# Altium schematic sheet FPGA_51_Wave_Player.SchDoc: LiveDesign Evaluation - Wave Player
size A3; Organization: Altium Limited; Address1: L3, 12a Rodborough Rd; Address2: Frenchs Forest; Address3: NSW; Address4: Australia 2086
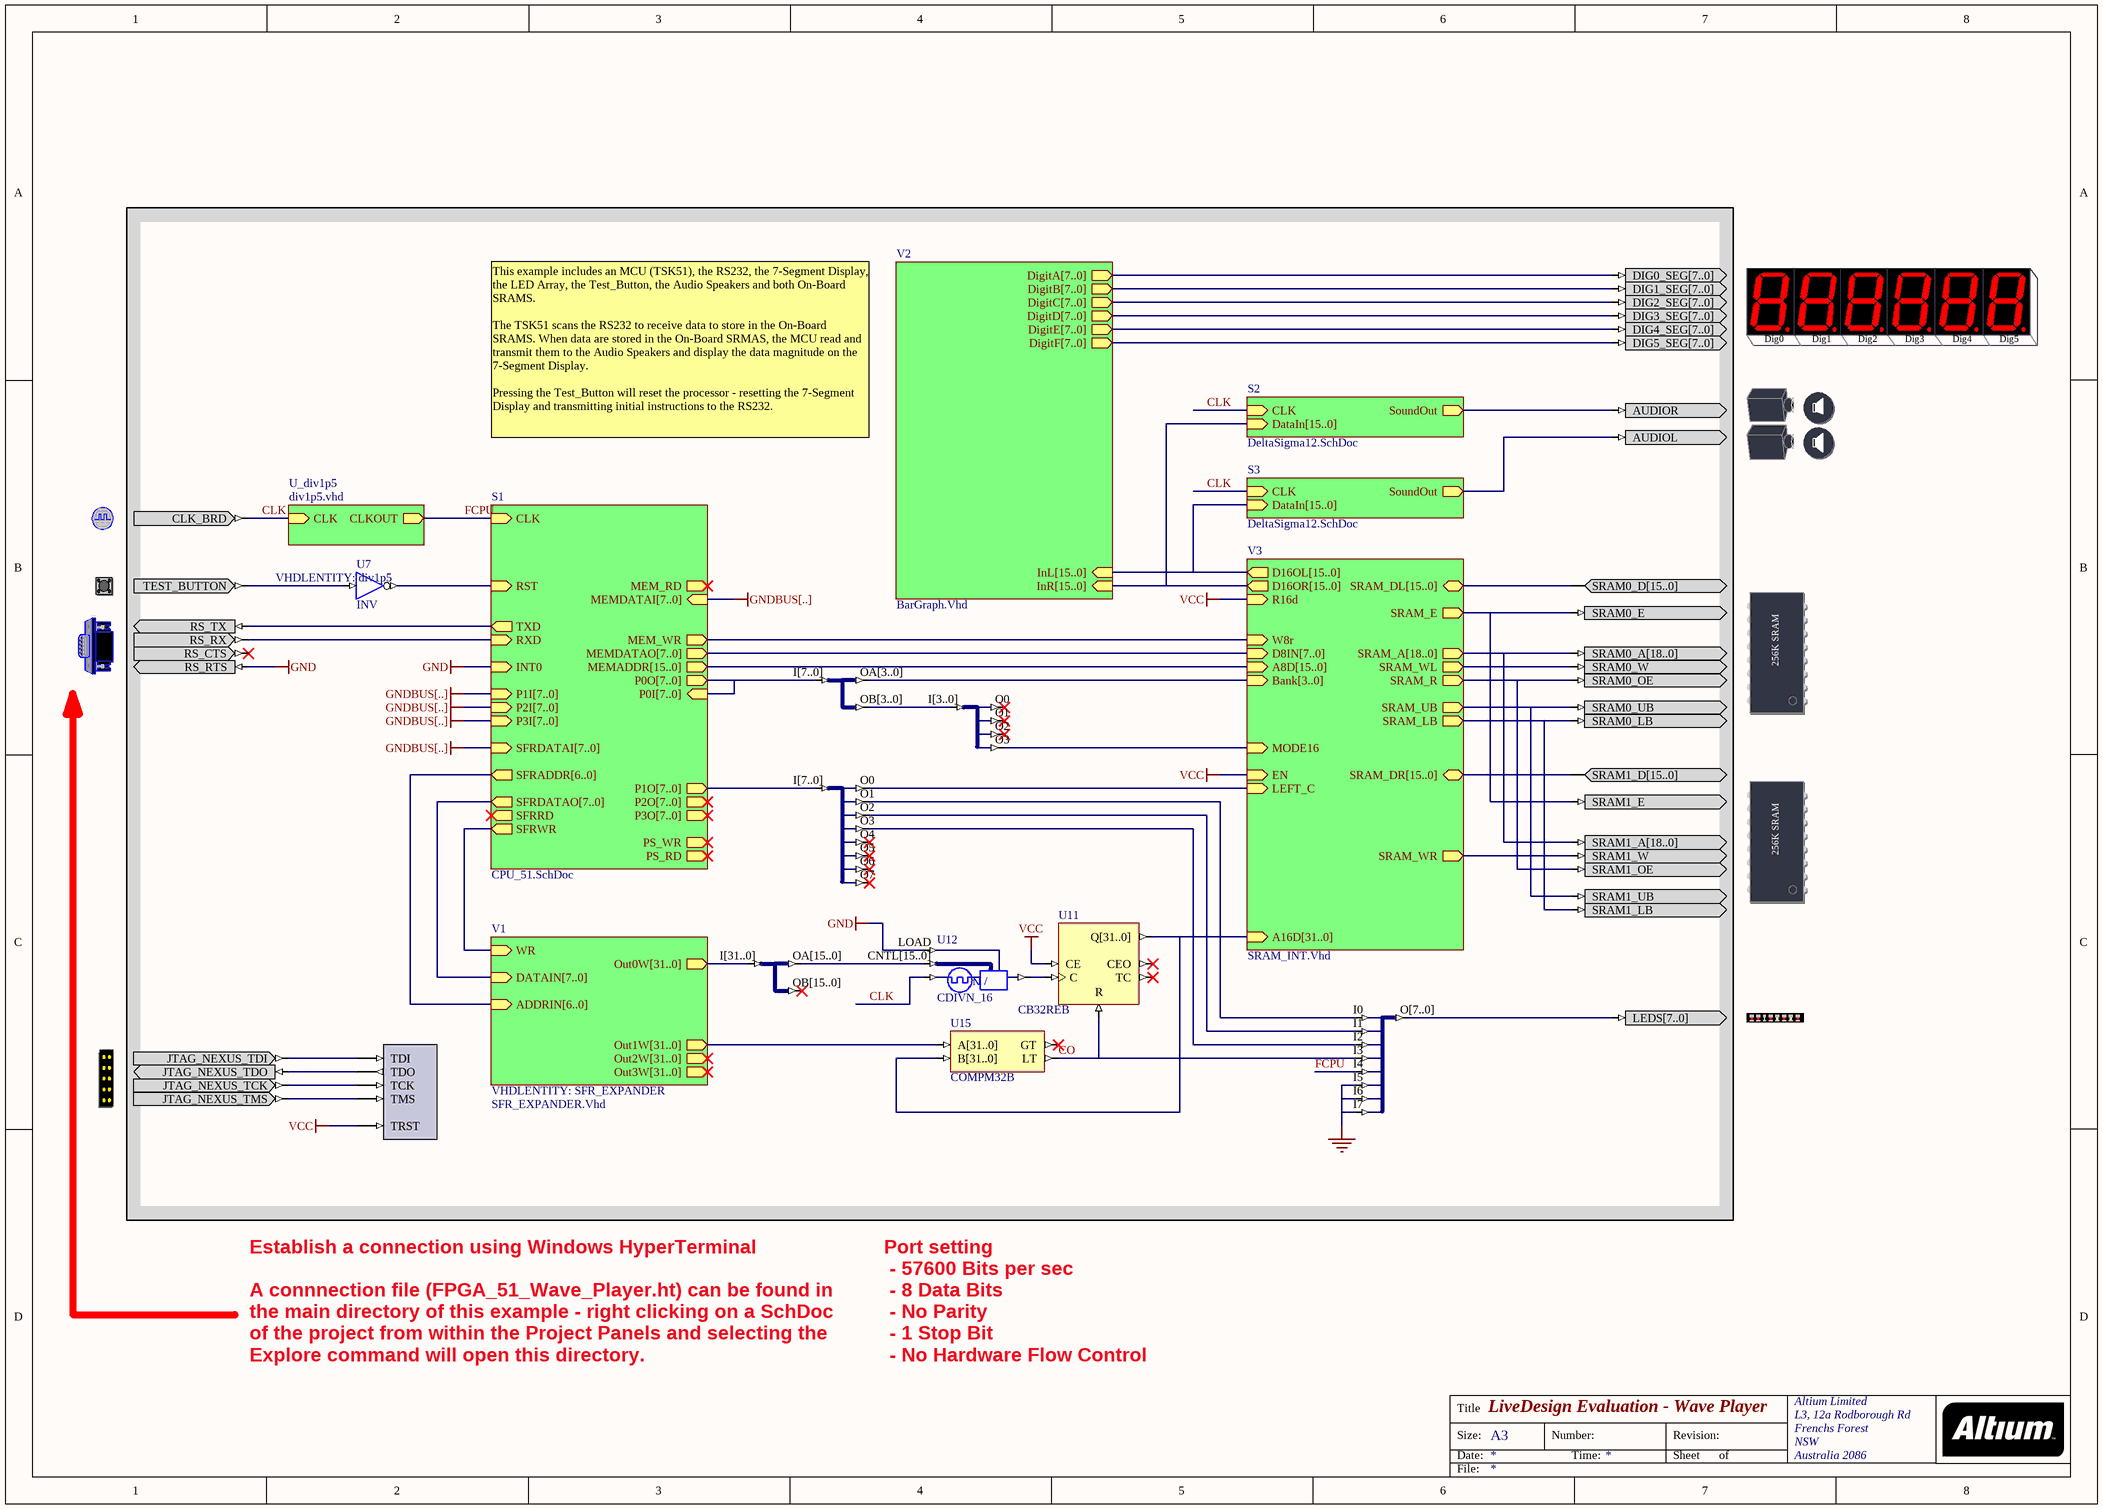
[diagram p0: FPGA_51_Wave_Player.SchDoc]

## Parts
7SEGX6  7SEGX6  (value not drawn)
CLOCK_BOARD  CLOCK_BOARD  (value not drawn)
LED  LED  (value not drawn)
NEXUS_JTAG_CONNECTOR  NEXUS_JTAG_CONNECTOR  (value not drawn)
NEXUS_JTAG_PORT  NEXUS_JTAG_PORT  (value not drawn)
RS232CNTR  RS232CNTR  (value not drawn)
SRAM_0  SRAM_0  (value not drawn)
SRAM_1  SRAM_1  (value not drawn)
STEREO  STEREO  (value not drawn)
TEST_BUTTON  TEST_BUTTON  (value not drawn)
U7  INV
U8  J8B_4B2  (value not drawn)
U9  J4B_4S  (value not drawn)
U10  J8B_8S  (value not drawn)
U11  CB32REB
U12  CDIVN_16
U13  J32B_16B2  (value not drawn)
U14  J8S_8B  (value not drawn)
U15  COMPM32B

## Sub-sheets
S1 = CPU_51.SchDoc: CLK (in), RXD (in), TXD (out), MEMADDR[15..0] (out), MEM_WR (out), MEM_RD (out), SFRDATAO[7..0] (out), SFRDATAI[7..0] (in), SFRWR (out), SFRRD (out), SFRADDR[6..0] (out), INT0 (in), P1O[7..0] (out), P1I[7..0] (in), MEMDATAO[7..0] (out), MEMDATAI[7..0] (in), PS_WR (out), PS_RD (out), P2O[7..0] (out), P0O[7..0] (out), P0I[7..0] (in), P2I[7..0] (in), P3O[7..0] (out), P3I[7..0] (in), RST (in)
S2 = DeltaSigma12.SchDoc: CLK (in), DataIn[15..0] (in), SoundOut (out)
S3 = DeltaSigma12.SchDoc: CLK (in), DataIn[15..0] (in), SoundOut (out)
U_div1p5 = div1p5.vhd: CLK (in), CLKOUT (out)  | VHDLENTITY: div1p5
V1 = SFR_EXPANDER.Vhd: ADDRIN[6..0] (in), DATAIN[7..0] (in), Out0W[31..0] (out), WR (in), Out2W[31..0] (out), Out3W[31..0] (out), Out1W[31..0] (out)  | VHDLENTITY: SFR_EXPANDER
V2 = BarGraph.Vhd: DigitA[7..0] (out), DigitB[7..0] (out), DigitC[7..0] (out), DigitD[7..0] (out), DigitE[7..0] (out), DigitF[7..0] (out), InL[15..0] (in), InR[15..0] (in)
V3 = SRAM_INT.Vhd: SRAM_DL[15..0] (bidir), SRAM_E (out), SRAM_A[18..0] (out), SRAM_WL (out), SRAM_R (out), SRAM_UB (out), SRAM_LB (out), Bank[3..0] (in), W8r (in), D8IN[7..0] (in), A8D[15..0] (in), D16OL[15..0] (out), R16d (in), A16D[31..0] (in), MODE16 (in), EN (in), D16OR[15..0] (out), SRAM_DR[15..0] (bidir), SRAM_WR (out), LEFT_C (in)

## Nets
GND: RS232CNTR.RS_RTS U12.LOAD U14.I5 U14.I6 U14.I7 ; sheet S1/INT0
VCC: NEXUS_JTAG_PORT.TRST U11.CE ; sheet V3/R16d, sheet V3/EN
CLK: CLOCK_BOARD.CLK_BRD U12.CLKIN ; sheet S3/CLK, sheet S2/CLK, sheet U_div1p5/CLK
CO: U11.R U14.I3 U15.LT
FCPU: U14.I4 ; sheet S1/CLK, sheet U_div1p5/CLKOUT
Net7SEGX6_DIG0_SEG[7..0]: 7SEGX6.DIG0_SEG[7..0] ; sheet V2/DigitA[7..0]
Net7SEGX6_DIG1_SEG[7..0]: 7SEGX6.DIG1_SEG[7..0] ; sheet V2/DigitB[7..0]
Net7SEGX6_DIG2_SEG[7..0]: 7SEGX6.DIG2_SEG[7..0] ; sheet V2/DigitC[7..0]
Net7SEGX6_DIG3_SEG[7..0]: 7SEGX6.DIG3_SEG[7..0] ; sheet V2/DigitD[7..0]
Net7SEGX6_DIG4_SEG[7..0]: 7SEGX6.DIG4_SEG[7..0] ; sheet V2/DigitE[7..0]
Net7SEGX6_DIG5_SEG[7..0]: 7SEGX6.DIG5_SEG[7..0] ; sheet V2/DigitF[7..0]
NetLED_LEDS[7..0]: LED.LEDS[7..0] U14.O[7..0]
NetNEXUS_JTAG_CONNECTOR_JTAG_NEXUS_TCK: NEXUS_JTAG_CONNECTOR.JTAG_NEXUS_TCK NEXUS_JTAG_PORT.TCK
NetNEXUS_JTAG_CONNECTOR_JTAG_NEXUS_TDI: NEXUS_JTAG_CONNECTOR.JTAG_NEXUS_TDI NEXUS_JTAG_PORT.TDI
NetNEXUS_JTAG_CONNECTOR_JTAG_NEXUS_TDO: NEXUS_JTAG_CONNECTOR.JTAG_NEXUS_TDO NEXUS_JTAG_PORT.TDO
NetNEXUS_JTAG_CONNECTOR_JTAG_NEXUS_TMS: NEXUS_JTAG_CONNECTOR.JTAG_NEXUS_TMS NEXUS_JTAG_PORT.TMS
NetRS232CNTR_RS_RX: RS232CNTR.RS_RX ; sheet S1/RXD
NetRS232CNTR_RS_TX: RS232CNTR.RS_TX ; sheet S1/TXD
NetSRAM_0_SRAM0_A[18..0]: SRAM_0.SRAM0_A[18..0] SRAM_1.SRAM1_A[18..0] ; sheet V3/SRAM_A[18..0]
NetSRAM_0_SRAM0_D[15..0]: SRAM_0.SRAM0_D[15..0] ; sheet V3/SRAM_DL[15..0]
NetSRAM_0_SRAM0_E: SRAM_0.SRAM0_E SRAM_1.SRAM1_E ; sheet V3/SRAM_E
NetSRAM_0_SRAM0_LB: SRAM_0.SRAM0_LB SRAM_1.SRAM1_LB ; sheet V3/SRAM_LB
NetSRAM_0_SRAM0_OE: SRAM_0.SRAM0_OE SRAM_1.SRAM1_OE ; sheet V3/SRAM_R
NetSRAM_0_SRAM0_UB: SRAM_0.SRAM0_UB SRAM_1.SRAM1_UB ; sheet V3/SRAM_UB
NetSRAM_0_SRAM0_W: SRAM_0.SRAM0_W ; sheet V3/SRAM_WL
NetSRAM_1_SRAM1_D[15..0]: SRAM_1.SRAM1_D[15..0] ; sheet V3/SRAM_DR[15..0]
NetSRAM_1_SRAM1_W: SRAM_1.SRAM1_W ; sheet V3/SRAM_WR
NetSTEREO_AUDIOL: STEREO.AUDIOL ; sheet S3/SoundOut
NetSTEREO_AUDIOR: STEREO.AUDIOR ; sheet S2/SoundOut
NetTEST_BUTTON_TEST_BUTTON: TEST_BUTTON.TEST_BUTTON U7.I
NetU7_O: U7.O ; sheet S1/RST
NetU8_I[7..0]: U8.I[7..0] ; sheet S1/P0O[7..0], sheet S1/P0I[7..0]
NetU8_OA[3..0]: U8.OA[3..0] ; sheet V3/Bank[3..0]
NetU8_OB[3..0]: U8.OB[3..0] U9.I[3..0]
NetU9_O3: U9.O3 ; sheet V3/MODE16
NetU10_I[7..0]: U10.I[7..0] ; sheet S1/P1O[7..0]
NetU10_O0: U10.O0 ; sheet V3/LEFT_C
NetU10_O1: U10.O1 U14.I0
NetU10_O2: U10.O2 U14.I1
NetU10_O3: U10.O3 U14.I2
NetU11_C: U11.C U12.CLKDV
NetU11_Q[31..0]: U11.Q[31..0] U15.B[31..0] ; sheet V3/A16D[31..0]
NetU12_CNTL[15..0]: U12.CNTL[15..0] U13.OA[15..0]
NetU13_I[31..0]: U13.I[31..0] ; sheet V1/Out0W[31..0]
NetU15_A[31..0]: U15.A[31..0] ; sheet V1/Out1W[31..0]
(unnamed): sheet S1/MEM_WR, sheet V3/W8r
(unnamed): sheet S1/SFRWR, sheet V1/WR

Not connected (* = marked no-connect by the designer): RS232CNTR RS_CTS*; U9 O0* O1* O2*; U10 O4* O5* O6* O7*; U11 CEO* TC*; U13 OB[15..0]*; U15 GT*

## Buses and harness runs
bus sheet S1/MEMADDR[15..0] = sheet V3/A8D[15..0]
bus sheet S1/MEMDATAO[7..0] = sheet V3/D8IN[7..0]
bus sheet S1/P0I[7..0] = sheet S1/P0O[7..0]
bus sheet S1/SFRADDR[6..0] = sheet V1/ADDRIN[6..0]
bus sheet S1/SFRDATAO[7..0] = sheet V1/DATAIN[7..0]
bus sheet S2/DataIn[15..0] = sheet V2/InR[15..0] = sheet V3/D16OR[15..0]
bus sheet S3/DataIn[15..0] = sheet V2/InL[15..0] = sheet V3/D16OL[15..0]

## Notes on the sheet
- This example includes an MCU (TSK51), the RS232, the 7-Segment Display, the LED Array, the Test_Button, the Audio Speakers and both On-Board SRAMS.
  The TSK51 scans the RS232 to receive data to store in the On-Board SRAMS. When data are stored in the On-Board SRMAS, the MCU read and transmit them to the Audio Speakers and display the data magnitude on the 7-Segment Display.
  Pressing the Test_Button will reset the processor - resetting the 7-Segment Display and transmitting initial instructions to the RS232.
- Establish a connection using Windows HyperTerminal
  A connnection file (FPGA_51_Wave_Player.ht) can be found in the main directory of this example - right clicking on a SchDoc of the project from within the Project Panels and selecting the Explore command will open this directory.
- Port setting
  - 57600 Bits per sec
  - 8 Data Bits
  - No Parity
  - 1 Stop Bit
  - No Hardware Flow Control
- Title
- Size:
- Date:
- A3
- Number:
- Time:
- Revision:
- Sheet
- of
- File:
- (in symbol 7SEGX6) Dig0; Dig1; Dig2; Dig3; Dig4; Dig5
- (in symbol CDIVN_16) / N
- (in symbol SRAM_0) 256K SRAM
- (in symbol SRAM_1) 256K SRAM

## Library data of the parts
7SEGX6 = 7SEGX6: 6 x 7 Segment display module; PortComponent: True; Publisher: Altium Limited; Published: 9-Sept-2004
CLOCK_BOARD = CLOCK_BOARD: Global System Clock Supply; PortComponent: True; Published: 19-Nov-2003; Publisher: Altium Limited
LED = LED: 8-Way LEDS; PortComponent: True; Published: 19-Nov-2003; Publisher: Altium Limited
NEXUS_JTAG_CONNECTOR = NEXUS_JTAG_CONNECTOR: JTAG Port; PortComponent: True; Published: 19-Nov-2003; Publisher: Altium Limited
NEXUS_JTAG_PORT = NEXUS_JTAG_PORT: Nexus Processor JTAG Chain Connector; NEXUS_JTAG_CONNECTOR: True; Published: 5-Sep-2003; Publisher: Altium Hobart Technology Centre
RS232CNTR = RS232CNTR: DCE Serial Port Connector; PortComponent: True; Published: 19-Nov-2003; Publisher: Altium Limited
SRAM_0 = SRAM_0: SRAM - 0 Module - 256K; PortComponent: True; Published: 13-May-2004; Publisher: Altium Limited
SRAM_1 = SRAM_1: SRAM - 1 Module - 256K; PortComponent: True; Published: 13-May-2004; Publisher: Altium Limited
STEREO = STEREO: Sound interface; PortComponent: True; Published: 19-Nov-2003; Publisher: Altium Limited
TEST_BUTTON = TEST_BUTTON: Test Button; PortComponent: True; Published: 19-Nov-2003; Publisher: Altium Limited
U7 = INV: Inverter; ArchiveName: GENERIC; VHDLIB_SIM: GENERIC_LIB; Published: 29-Jan-2004; Publisher: Altium Limited; Xilinx Equivalent: INV; Core Revision: 1.00.00
U8 = J8B_4B2: 1 x 8-bit input bus to 2 x 4-Bit output bus; ArchiveName: GENERIC; VHDLIB_SIM: GENERIC_LIB; Published: 29-Jan-2004; Publisher: Altium Limited; Core Revision: 1.00.00
U9 = J4B_4S: 4-Bit input bus to 4 Single pin outputs; ArchiveName: GENERIC; VHDLIB_SIM: GENERIC_LIB; Published: 29-Jan-2004; Publisher: Altium Limited; Core Revision: 1.00.00
U10 = J8B_8S: 8-Bit input bus to 8 single pin outputs; ArchiveName: GENERIC; VHDLIB_SIM: GENERIC_LIB; Published: 29-Jan-2004; Publisher: Altium Limited; Core Revision: 1.00.00
U11 = CB32REB: 32-Bit Cascadable Binary Counter with Clock Enable and Synchronous Reset, Bus Version; ArchiveName: GENERIC; VHDLIB_SIM: GENERIC_LIB; Published: 31-May-2004; Publisher: Altium Limited; Core Revision: 1.00.00
U12 = CDIVN_16: 16-Bit Programmable Clock Divider; ArchiveName: GENERIC; VHDLIB_SIM: GENERIC_LIB; Published: 29-Jan-2004; Publisher: Altium Limited; Core Revision: 1.00.00
U13 = J32B_16B2: 1 x 32-bit input bus to 2 x 16-Bit output bus; ArchiveName: GENERIC; VHDLIB_SIM: GENERIC_LIB; Published: 29-Jan-2004; Publisher: Altium Limited; Core Revision: 1.00.00
U14 = J8S_8B: 8 Single pin inputs to single 8-Bit output bus; ArchiveName: GENERIC; VHDLIB_SIM: GENERIC_LIB; Published: 29-Jan-2004; Publisher: Altium Limited; Core Revision: 1.00.00
U15 = COMPM32B: 32-Bit Magnitude Comparator, Bus Version; ArchiveName: GENERIC; VHDLIB_SIM: GENERIC_LIB; Published: 31-May-2004; Publisher: Altium Limited; Core Revision: 1.00.00